# Altium schematic sheet O.schdoc
size 313 x 179 mm
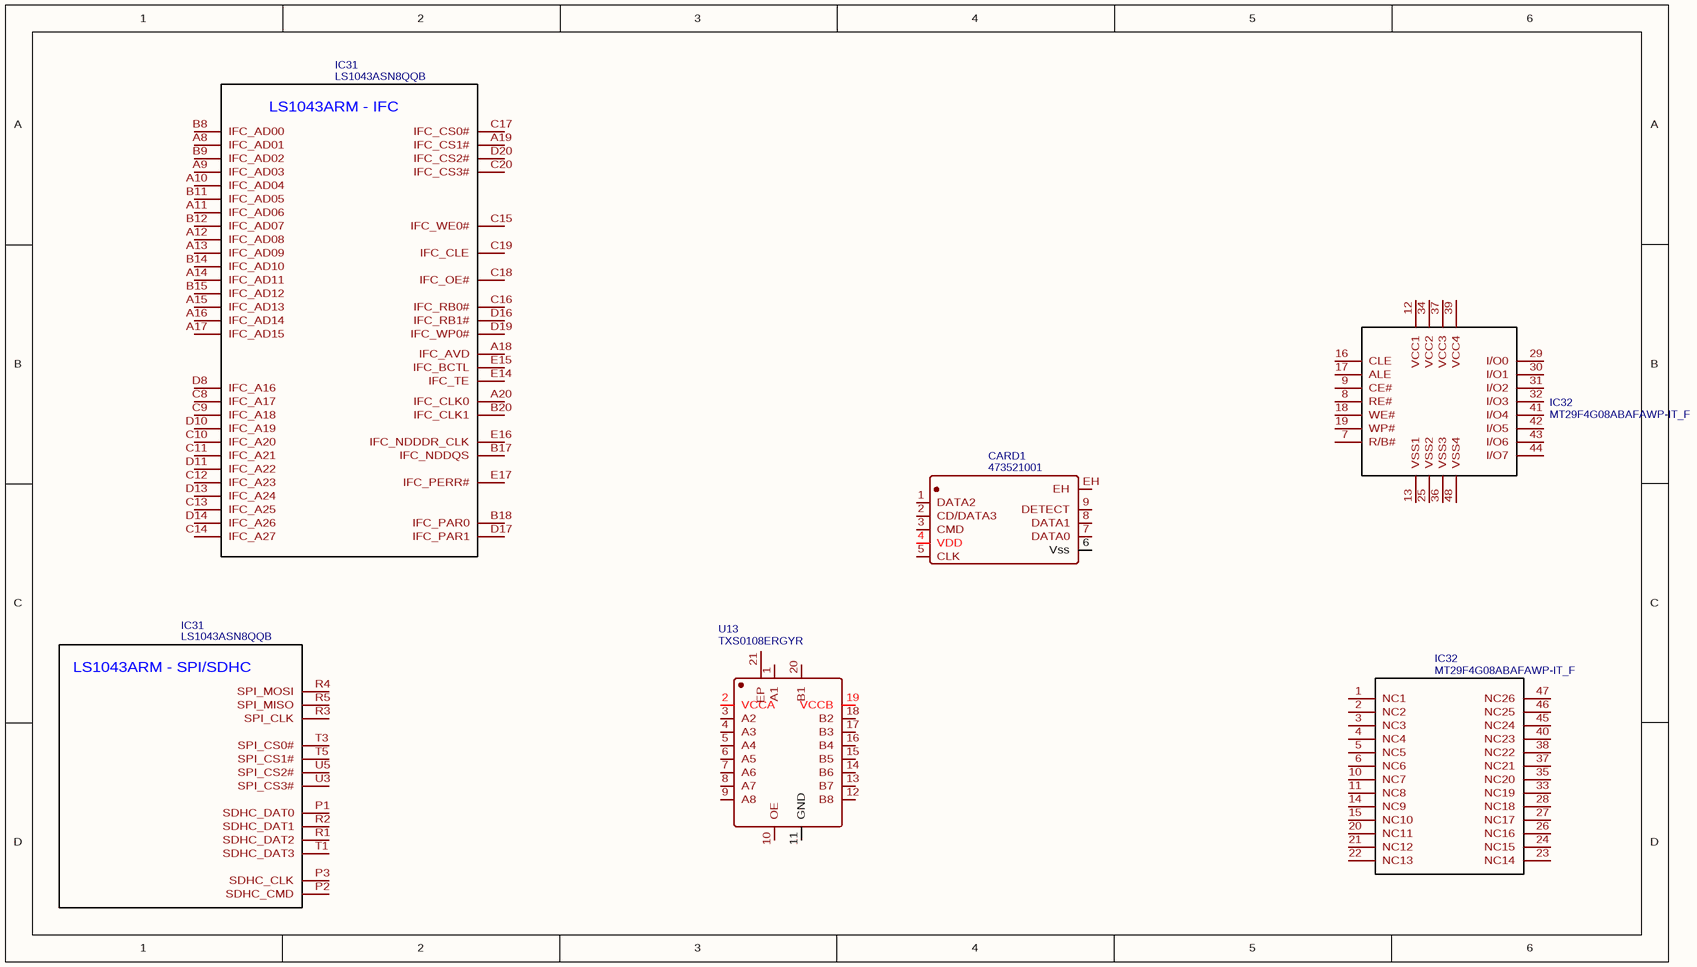
[diagram p0: O.schdoc]

## Parts
(Parts that share a designator on the sheet are numbered #1, #2 ... from top to bottom, then left to right.)
CARD1  473521001  [SD-SMD_SD-47352-101]
IC31#1  LS1043ASN8QQB  [BGA621C65P25X25_1700X1700X218N]
IC31#2  LS1043ASN8QQB  [BGA621C65P25X25_1700X1700X218N]
IC32#1  MT29F4G08ABAFAWP-IT_F  [SOP50P2000X120-48N]
IC32#2  MT29F4G08ABAFAWP-IT_F  [SOP50P2000X120-48N]
U13  TXS0108ERGYR  [VQFN-20_L4.7-W3.7-P0.50-BL-EP]

## Nets

Not connected (* = marked no-connect by the designer): CARD1 1(DATA2) 2(CD/DATA3) 3(CMD) 4(VDD) 5(CLK) 6(Vss) 7(DATA0) 8(DATA1) 9(DETECT) EH; IC31#1 A8(IFC_AD01) A9(IFC_AD03) A10(IFC_AD04) A11(IFC_AD06) A12(IFC_AD08) A13(IFC_AD09) A14(IFC_AD11) A15(IFC_AD13) A16(IFC_AD14) A17(IFC_AD15) A18(IFC_AVD) A19(IFC_CS1#) A20(IFC_CLK0) B8(IFC_AD00) B9(IFC_AD02) B11(IFC_AD05) B12(IFC_AD07) B14(IFC_AD10) B15(IFC_AD12) B17(IFC_NDDQS) B18(IFC_PAR0) B20(IFC_CLK1) C8(IFC_A17) C9(IFC_A18) C10(IFC_A20) C11(IFC_A21) C12(IFC_A23) C13(IFC_A25) C14(IFC_A27) C15(IFC_WE0#) C16(IFC_RB0#) C17(IFC_CS0#) C18(IFC_OE#) C19(IFC_CLE) C20(IFC_CS3#) D8(IFC_A16) D10(IFC_A19) D11(IFC_A22) D13(IFC_A24) D14(IFC_A26) D16(IFC_RB1#) D17(IFC_PAR1) D19(IFC_WP0#) D20(IFC_CS2#) E14(IFC_TE) E15(IFC_BCTL) E16(IFC_NDDDR_CLK) E17(IFC_PERR#); IC31#2 P1(SDHC_DAT0) P2(SDHC_CMD) P3(SDHC_CLK) R1(SDHC_DAT2) R2(SDHC_DAT1) R3(SPI_CLK) R4(SPI_MOSI) R5(SPI_MISO) T1(SDHC_DAT3) T3(SPI_CS0#) T5(SPI_CS1#) U3(SPI_CS3#) U5(SPI_CS2#); IC32#1 7(R/B#) 8(RE#) 9(CE#) 12(VCC1) 13(VSS1) 16(CLE) 17(ALE) 18(WE#) 19(WP#) 25(VSS2) 29(I/O0) 30(I/O1) 31(I/O2) 32(I/O3) 34(VCC2) 36(VSS3) 37(VCC3) 39(VCC4) 41(I/O4) 42(I/O5) 43(I/O6) 44(I/O7) 48(VSS4); IC32#2 1(NC1) 2(NC2) 3(NC3) 4(NC4) 5(NC5) 6(NC6) 10(NC7) 11(NC8) 14(NC9) 15(NC10) 20(NC11) 21(NC12) 22(NC13) 23(NC14) 24(NC15) 26(NC16) 27(NC17) 28(NC18) 33(NC19) 35(NC20) 37(NC21) 38(NC22) 40(NC23) 45(NC24) 46(NC25) 47(NC26); U13 1(A1) 2(VCCA) 3(A2) 4(A3) 5(A4) 6(A5) 7(A6) 8(A7) 9(A8) 10(OE) 11(GND) 12(B8) 13(B7) 14(B6) 15(B5) 16(B4) 17(B3) 18(B2) 19(VCCB) 20(B1) 21(EP)

## Notes on the sheet
- (in symbol LS1043ASN8QQB) LS1043ARM - IFC; LS1043ARM - SPI/SDHC

## Library data of the parts
CARD1 = 473521001: BOM_Manufacturer: MOLEX; Contributor: LCSC; BOM_Supplier: LCSC; BOM_Supplier Part: C293569; BOM_Manufacturer Part: 473521001; spicePre: C; spiceSymbolName: 473521001
IC31#1 IC31#2 = LS1043ASN8QQB: subpart_no: 1; Contributor: Ke'Ondrae_Mell; spicePre: I; spiceSymbolName: LS1043ASN8QQB
IC32#1 IC32#2 = MT29F4G08ABAFAWP-IT_F: subpart_no: 1; Contributor: Ke'Ondrae_Mell; spicePre: I; spiceSymbolName: MT29F4G08ABAFAWP-IT_F
U13 = TXS0108ERGYR: BOM_Manufacturer: Texas Instruments; Contributor: LCSC; SMT Type: Extend; BOM_Supplier: LCSC; BOM_Supplier Part: C90706; BOM_Manufacturer Part: TXS0108ERGYR; BOM_LCSC Assembly: Yes; spicePre: U; spiceSymbolName: TXS0108ERGYR